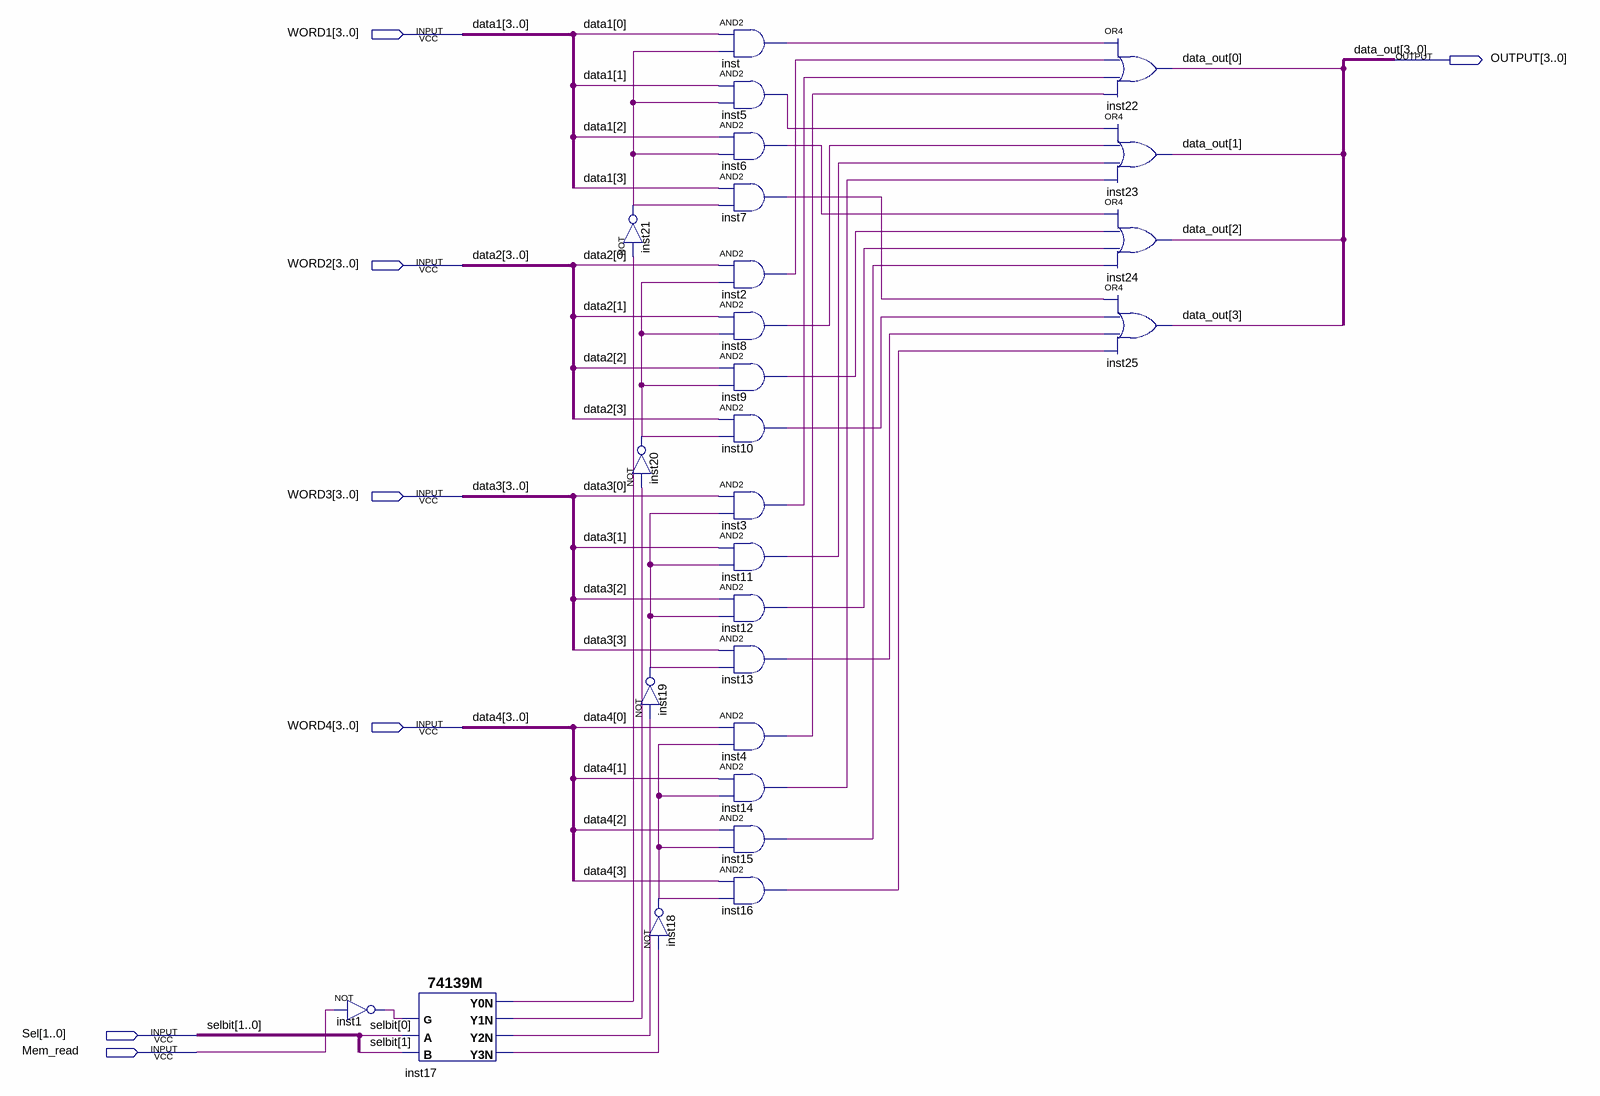
[diagram p0: schematic sheet]
// Quartus schematic bitBuffer.bdf as structural Verilog: 26 symbols, 7 pins
module bitBuffer (
  input  [3:0] WORD1,
  input  [3:0] WORD2,
  input  [3:0] WORD3,
  input  [3:0] WORD4,
  input  [1:0] Sel,
  input  Mem_read,
  output [3:0] OUTPUT
);

  wire inst1_out, inst2_out, inst3_out, inst4_out, inst5_out, inst6_out, inst7_out, inst8_out, inst9_out,
       inst10_out, inst11_out, inst12_out, inst13_out, inst14_out, inst15_out, inst16_out, inst17_y0n,
       inst17_y1n, inst17_y2n, inst17_y3n, inst18_out, inst19_out, inst20_out, inst21_out, inst_out;

  not inst1 (inst1_out, Mem_read);
  \74139M  inst17 (
    .B(Sel[1]), .A(Sel[0]), .G(inst1_out), .Y3N(inst17_y3n), .Y2N(inst17_y2n), .Y0N(inst17_y0n),
    .Y1N(inst17_y1n));
  not inst21 (inst21_out, inst17_y0n);
  not inst20 (inst20_out, inst17_y1n);
  not inst19 (inst19_out, inst17_y2n);
  not inst18 (inst18_out, inst17_y3n);
  and inst (inst_out, WORD1[0], inst21_out);
  and inst5 (inst5_out, WORD1[1], inst21_out);
  and inst6 (inst6_out, WORD1[2], inst21_out);
  and inst7 (inst7_out, WORD1[3], inst21_out);
  and inst2 (inst2_out, WORD2[0], inst20_out);
  and inst8 (inst8_out, WORD2[1], inst20_out);
  and inst9 (inst9_out, WORD2[2], inst20_out);
  and inst10 (inst10_out, WORD2[3], inst20_out);
  and inst3 (inst3_out, WORD3[0], inst19_out);
  and inst11 (inst11_out, WORD3[1], inst19_out);
  and inst12 (inst12_out, WORD3[2], inst19_out);
  and inst13 (inst13_out, WORD3[3], inst19_out);
  and inst4 (inst4_out, WORD4[0], inst18_out);
  and inst14 (inst14_out, WORD4[1], inst18_out);
  and inst15 (inst15_out, WORD4[2], inst18_out);
  and inst16 (inst16_out, WORD4[3], inst18_out);
  or inst22 (OUTPUT[0], inst_out, inst2_out, inst3_out, inst4_out);
  or inst23 (OUTPUT[1], inst5_out, inst8_out, inst11_out, inst14_out);
  or inst24 (OUTPUT[2], inst6_out, inst9_out, inst12_out, inst15_out);
  or inst25 (OUTPUT[3], inst7_out, inst10_out, inst13_out, inst16_out);

  // Other names for the same wires on the sheet: data1[3:0] = WORD1; data2[3:0] = WORD2; data3[3:0] = WORD3;
  //   data4[3:0] = WORD4; data_out[3:0] = OUTPUT; selbit[1:0] = Sel
endmodule
